# Altium schematic sheet CANOPi_Baseboard_LTE.SchDoc
size A4; DocumentNumber: 4; SheetNumber: 4; SheetTotal: 5; CopyrightYear: 2021
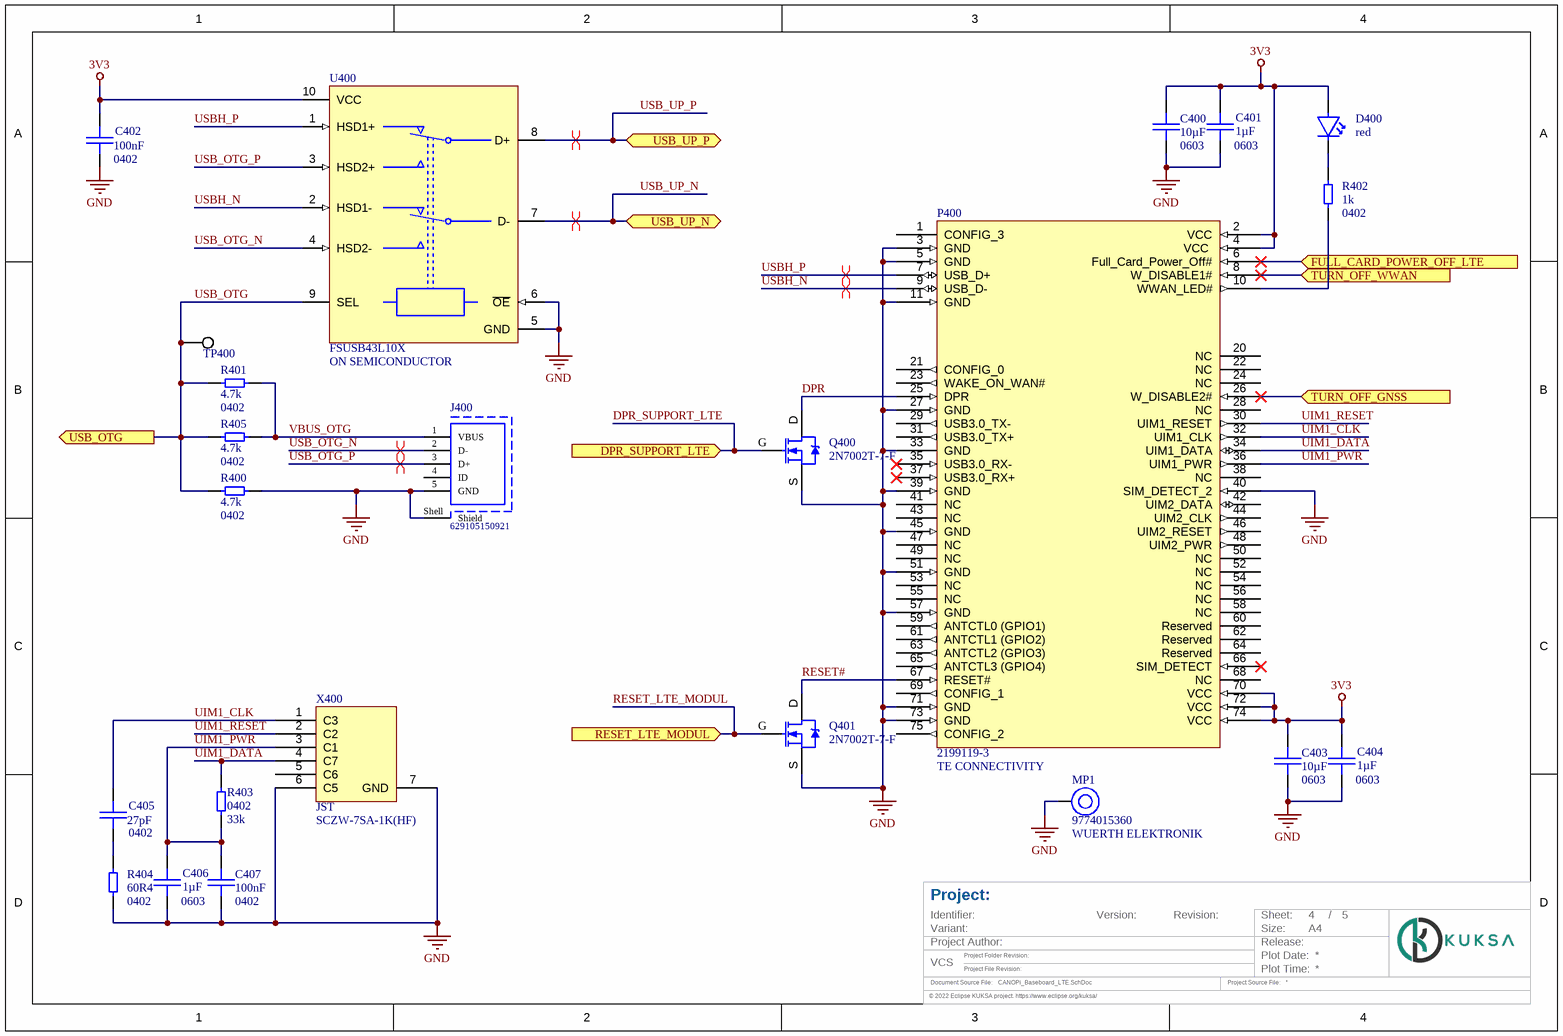
[diagram p0: CANOPi_Baseboard_LTE.SchDoc]

## Parts
C400  Capacitance: 10µF  Case: 0603  [CAP 0603 [1608 Metric] X080 N]  (hidden comment: CAP 0603 10µF -20% +20% 6.3V X5R)
C401  Capacitance: 1µF  Case: 0603  [CAP 0603 [1608 Metric] X080 N]  (hidden comment: CAP 0603 1u -10% +10% 10V X7R)
C402  Capacitance: 100nF  Case: 0402  [CAP 0402 [1005 Metric] X050 N]  (hidden comment: CAP 0402 100n -10% +10% 6.3V X7R)
C403  Capacitance: 10µF  Case: 0603  [CAP 0603 [1608 Metric] X080 N]  (hidden comment: CAP 0603 10µF -20% +20% 6.3V X5R)
C404  Capacitance: 1µF  Case: 0603  [CAP 0603 [1608 Metric] X080 N]  (hidden comment: CAP 0603 1u -10% +10% 10V X7R)
C405  Case: 0402  Capacitance: 27pF  [CAP 0402 [1005 Metric] X050 N]  (hidden comment: CAP 0402 27p -2% +2% 25V C0G)
C406  Capacitance: 1µF  Case: 0603  [CAP 0603 [1608 Metric] X080 N]  (hidden comment: CAP 0603 1u -10% +10% 10V X7R)
C407  Capacitance: 100nF  Case: 0402  [CAP 0402 [1005 Metric] X050 N]  (hidden comment: CAP 0402 100n -10% +10% 6.3V X7R)
D400  Colour LED1: red  [WUERTH ELEKTRONIK - WL-SMSW]  (hidden comment: WUERTH ELEKTRONIK - 155124RS73200)
J400  629105150921  [629105150921]
MP1  Manufacturer Part Number: 9774015360  Manufacturer: WUERTH ELEKTRONIK  [WUERTH ELEKTRONIK - 9774015360]  (hidden comment: WUERTH ELEKTRONIK - 9774015360)
P400  Manufacturer Part Number: 2199119-3  Manufacturer: TE CONNECTIVITY  [M.2 (NGFF) Connectors]  (hidden comment: TE CONNECTIVITY - 2199119-3)
Q400  Manufacturer Part Number: 2N7002T-7-F  [DIODES INCORPORATED - SOT523]  (hidden comment: DIODES INCORPORATED - 2N7002T)
Q401  Manufacturer Part Number: 2N7002T-7-F  [DIODES INCORPORATED - SOT523]  (hidden comment: DIODES INCORPORATED - 2N7002T)
R400  Resistance: 4.7k  Case: 0402  [RES 0402 [1005 Metric]_N]  (hidden comment: RES 0402 4K7 1% 0W0625)
R401  Resistance: 4.7k  Case: 0402  [RES 0402 [1005 Metric]_N]  (hidden comment: RES 0402 4K7 1% 0W0625)
R402  Case: 0402  Resistance: 1k  [RES 0402 [1005 Metric]_N]  (hidden comment: RES 0402 1K 1% 0W0625)
R403  Case: 0402  Resistance: 33k  [RES 0402 [1005 Metric]_N]  (hidden comment: RES 0402 33K 1% 0W0625)
R404  Resistance: 60R4  Case: 0402  [RES 0402 [1005 Metric]_N]  (hidden comment: RES 0402 60R4 1% 0W0625)
R405  Resistance: 4.7k  Case: 0402  [RES 0402 [1005 Metric]_N]  (hidden comment: RES 0402 4K7 1% 0W0625)
TP400  Testpad, 0.8mm x 0.8mm, round  [Testpad, 0.8mm x 0.8mm, round]  (value not drawn)  (no BOM)
U400  Manufacturer Part Number: FSUSB43L10X  Manufacturer: ON SEMICONDUCTOR  [ON SEMICONDUCTOR - FSUSB43L10X]  (hidden comment: ON SEMICONDUCTOR - FSUSB43L10X)
X400  Manufacturer: JST  Manufacturer Part Number: SCZW-7SA-1K(HF)  [JST SCZW-7SA-1K(HF)]  (hidden comment: JST - SCZW-7SA-1K(HF))

## Ports
DPR_SUPPORT_LTE (in), FULL_CARD_POWER_OFF_LTE (in), RESET_LTE_MODUL (in), TURN_OFF_GNSS (in), TURN_OFF_WWAN (in), USB_OTG (out), USB_UP_N (bidir), USB_UP_P (bidir)

## Nets
3V3: C400.1 C401.1 C402.2 C403.1 C404.1 D400.A P400.2(VCC) P400.4(VCC) P400.70(VCC) P400.72(VCC) P400.74(VCC) U400.10(VCC)
GND: C400.2 C401.2 C402.1 C403.2 C404.2 C406.2 C407.2 J400.5(GND) J400.Shell(Shield) MP1.1 P400.3(GND) P400.5(GND) P400.11(GND) P400.27(GND) P400.33(GND) P400.39(GND) P400.40(SIM_DETECT_2) P400.45(GND) P400.51(GND) P400.57(GND) P400.71(GND) P400.73(GND) Q400.S Q401.S R400.1 R404.1 U400.5(GND) U400.6(~{OE}) X400.6(C5) X400.7(GND)
DPR: P400.25(DPR) Q400.D
DPR_SUPPORT_LTE: Q400.G ; port DPR_SUPPORT_LTE
FULL_CARD_POWER_OFF_LTE: P400.6(Full_Card_Power_Off#) ; port FULL_CARD_POWER_OFF_LTE
RESET#: P400.67(RESET#) Q401.D
RESET_LTE_MODUL: Q401.G ; port RESET_LTE_MODUL
TURN_OFF_GNSS: P400.26(W_DISABLE2#) ; port TURN_OFF_GNSS
TURN_OFF_WWAN: P400.8(W_DISABLE1#) ; port TURN_OFF_WWAN
UIM1_CLK: C405.2 P400.32(UIM1_CLK) X400.1(C3)
UIM1_DATA: P400.34(UIM1_DATA) R403.1 X400.4(C7)
UIM1_PWR: C406.1 C407.1 P400.36(UIM1_PWR) R403.2 X400.3(C1)
UIM1_RESET: P400.30(UIM1_RESET) X400.2(C2)
USB_OTG: R400.2 R401.2 R405.2 TP400.1 U400.9(SEL) ; port USB_OTG
USB_OTG_N: J400.2(D-) U400.4(HSD2-)
USB_OTG_P: J400.3(D+) U400.3(HSD2+)
USB_UP_N: U400.7(D-) ; port USB_UP_N
USB_UP_P: U400.8(D+) ; port USB_UP_P
USBH_N: P400.9(USB_D-) U400.2(HSD1-)
USBH_P: P400.7(USB_D+) U400.1(HSD1+)
VBUS_OTG: J400.1(VBUS) R401.1 R405.1
NetC405_1: C405.1 R404.2
NetD400_C: D400.C R402.2
NetP400_10: P400.10(WWAN_LED#) R402.1

Not connected (* = marked no-connect by the designer): J400 4(ID); P400 1(CONFIG_3) 20(NC) 21(CONFIG_0) 22(NC) 23(WAKE_ON_WAN#) 24(NC) 28(NC) 29(USB3.0_TX-) 31(USB3.0_TX+) 35(USB3.0_RX-)* 37(USB3.0_RX+)* 38(NC) 41(NC) 42(UIM2_DATA) 43(NC) 44(UIM2_CLK) 46(UIM2_RESET) 47(NC) 48(UIM2_PWR) 49(NC) 50(NC) 52(NC) 53(NC) 54(NC) 55(NC) 56(NC) 58(NC) 59(ANTCTL0_(GPIO1)) 60(Reserved) 61(ANTCTL1_(GPIO2)) 62(Reserved) 63(ANTCTL2_(GPIO3)) 64(Reserved) 65(ANTCTL3_(GPIO4)) 66(SIM_DETECT)* 68(NC) 69(CONFIG_1) 75(CONFIG_2); X400 5(C6)

## Layout directives
differential pair: USB_OTG_N, USB_OTG_P, USB_UP_N, USB_UP_P, USBH_N, USBH_P

## Notes on the sheet
- Project:
- Identifier:
- Version:
- Revision:
- Sheet:
- /
- VCS
- Variant:
- Document Source File:
- Project Author:
- Project Folder Revision:
- Project File Revision:
- Project Source File:
- Plot Date:
- Size:
- Plot Time:
- Release:
- A4
- © 2022 Eclipse KUKSA project. https://www.eclipse.org/kuksa/
- Drawn by:
- © Robert Bosch GmbH         . All rights reserved, also regarding any disposal, exploitation, reproduction, editing, distribution, as well as in the event of applications for industrial property rights.

## Library data of the parts
C400 C403 = CMP-06061-3: SMT 10µF ±20% 6,3 V Keramikkondensatoren X5R; Manufacturer Part Number: GRM188R60J106ME84; Manufacturer: MURATA; Voltage Rating: 6,3V; Assembly: yes; Operating Temperature max: 85°C; IPC Footprint Naming: CAPC1608X080; Mounting Type: SMT; Dielectric Type: X5R; Value: 10µF; ComponentLink1Description: Datasheet; Capacitance Tolerance pos: 20%; ComponentLink1URL: https://search.murata.co.jp/Ceramy/image/img/A01X/G101/ENG/GRM188R60J106ME84-01.pdf; Operating Temperature min: -55°C; Capacitance Tolerance neg: -20%
C401 C404 C406 = CMP-02997-5: SMD/SMT 0603 10V -10% +10% X7R - Multilayer Ceramic Capacitors MLCC; Manufacturer Part Number: GRM188R71A105KA61#; Manufacturer: MURATA; Capacitance Tolerance pos: 10%; Value: 1µF; Assembly: yes; IPC Footprint Naming: CAPC1608X080; Voltage Rating: 10V; Mounting Type: SMT; Operating Temperature max: 125°C; Operating Temperature min: -55°C; ComponentLink1Description: Datasheet; Capacitance Tolerance neg: -10%; ComponentLink1URL: http://psearch.en.murata.com/capacitor/lineup/grm/; Dielectric Type: X7R
C402 C407 = CMP-04212-4: SMD/SMT 0402 6.3V -10% +10% X7R - Multilayer Ceramic Capacitors MLCC; Manufacturer: MURATA; Manufacturer Part Number: GRM155R70J104KA01#; Capacitance Tolerance pos: 10%; Value: 100nF; Assembly: yes; Operating Temperature min: -55°C; Voltage Rating: 6.3V; Operating Temperature max: 125°C; ComponentLink1URL: http://psearch.en.murata.com/capacitor/lineup/grm/; IPC Footprint Naming: CAPC1005X050; Capacitance Tolerance neg: -10%; ComponentLink1Description: Datasheet; Dielectric Type: X7R; Mounting Type: SMT
C405 = CMP-03814-4: SMD/SMT 0402 25V -2% +2% C0G - Multilayer Ceramic Capacitors MLCC; Manufacturer: MURATA; Manufacturer Part Number: GRM1555C1E270GA01#; Assembly: yes; Capacitance Tolerance pos: 2%; Value: 27pF; Dielectric Type: C0G (NP0); ComponentLink1Description: Datasheet; ComponentLink1URL: http://psearch.en.murata.com/capacitor/lineup/grm/; IPC Footprint Naming: CAPC1005X050; Voltage Rating: 25V; Operating Temperature min: -55°C; Mounting Type: SMT; Operating Temperature max: 125°C; Capacitance Tolerance neg: -2%
D400 = CMP-11201-1: LED, RED, Right Angle SMD 3.2*1.0mm WL-SMSW SMT Mono-color Side view Waterclear; View Angle: 120°; Wavelength LED1: 470nm; Reverse Voltage LED1: 5V; Forward Voltage LED1: 2V; Luminous Intensity LED1: 150mcd; Forward Current LED1: 25mA; Assembly: yes; Case: 1305; Operating Temperature max: 85°C; ComponentLink1Description: Datahseet; Manufacturer: WUERTH ELEKTRONIK; Operating Temperature min: -40°C; ComponentLink1URL: https://katalog.we-online.de/led/datasheet/155124BS73200.pdf; Mounting Type: SMT; Manufacturer Part Number: 155124RS73200
J400 = CMP-1502-03249-1: Micro USB 2.0 Type AB Receptacle WR-COM, Horizontal, SMT; Manufacturer: Wurth Elektronik; Rated Current: 1.8A; Contact Resistance: 30mOhm; Working Voltage: 30VAC; Publisher: WurthElektronik; Part Number: 629105150921; Operating Temperature: -40to85degC; Gender: Receptacle; Packaging: TapeandReel; Connector Type: MicroUSB2.0TypeAB; Datasheet URL: https://katalog.we-online.de/em/datasheet/629105150921.pdf; Mounting Technology: SMT; Orientation: Horizontal; Package Reference: 629105150921; Manufacturer URL: http://www.we-online.de
MP1 = CMP-12571-3: WA-SMSI SMT Steel Spacer with internal Thread, OD 6mm, M3 x 1.5mm; Assembly: yes; Operating Temperature max: 150°C; ComponentLink1URL: https://www.we-online.com/components/products/datasheet/9774015360.pdf; Operating Temperature min: -55°C; ComponentLink1Description: Manufacturer Link
P400 = CMP-06102-7: The M.2 (Next Generation Form Factor) product line is a natural transition from the Mini Card and Half Mini Card to a smaller form factor in both size and volume.; Voltage Rating: 50V; Pitch Spacing: 500µm; Gender: male; Current Rating: 500mA; Assembly: yes; ComponentLink1Description: Datasheet; Operating Temperature min: -40°C; Number of Pins: 67; Operating Temperature max: 80°C; Mounting Type: SMT; Number of Rows: 2
Q400 Q401 = CMP-11252-1: N-CHANNEL ENHANCEMENT MODE FIELD EFFECT TRANSISTOR; Assembly: yes; Drain Current DC: 150mA; Drain Source On Resistance: 2; Drain Source Voltage: 60V; Gate Source Voltage: 20V; Threshold Voltage: 2V; Mounting Type: SMT; Operating Temperature min: -55°C; ComponentLink1Description: Manufacturer Link; Transistor Polarity: N-Channel; Manufacturer: DIODES INCORPORATED; Operating Temperature max: 150°C; ComponentLink1URL: https://www.diodes.com/assets/Datasheets/ds30301.pdf; IPC Footprint Naming: SOT523; Case: SOT523
R400 R401 R405 = CMP-00920-7: RC0402 series chip resistor with lead-free terminations made by thick film process; Manufacturer Part Number: RC0402FR-074K7L; Manufacturer: YAGEO; Value: 4.7k; Power Rating: 62.5mW; Assembly: yes; Voltage Rating: 50V; Current Rating: 1A; Temperature Coefficient: ±100ppm/K; ComponentLink1URL: https://www.yageo.com/upload/media/product/productsearch/datasheet/rchip/PYu-RC_Group_51_RoHS_L_10.pdf; Operating Temperature max: 155°C; IPC Footprint Naming: RESC1005X04; Resistor Element Type: Thick Film; Mounting Type: SMT; Operating Temperature min: -55°C; ComponentLink1Description: Datasheet; Resistance Tolerance: 1%
R402 = CMP-00843-5: RC0402 series chip resistor with lead-free terminations made by thick film process; Manufacturer Part Number: RC0402FR-071KL; Manufacturer: YAGEO; Power Rating: 62.5mW; Current Rating: 1A; Temperature Coefficient: ±100ppm/K; Voltage Rating: 50V; Assembly: yes; Resistance Tolerance: 1%; ComponentLink1URL: http://www.yageo.com/documents/recent/PYu-RC0402_51_RoHS_L_6.pdf; Mounting Type: SMT; Value: 1k; Operating Temperature min: -55°C; ComponentLink1Description: Datasheet; IPC Footprint Naming: RESC1005X04; Operating Temperature max: 155°C; Resistor Element Type: Thick Film
R403 = CMP-01017-5: RC0402 series chip resistor with lead-free terminations made by thick film process; Manufacturer: YAGEO; Manufacturer Part Number: RC0402FR-0733KL; Assembly: yes; Power Rating: 62.5mW; Voltage Rating: 50V; Temperature Coefficient: ±100ppm/K; Current Rating: 1A; Operating Temperature max: 155°C; ComponentLink1URL: http://www.yageo.com/documents/recent/PYu-RC0402_51_RoHS_L_6.pdf; Resistor Element Type: Thick Film; Value: 33k; Mounting Type: SMT; ComponentLink1Description: Datasheet; IPC Footprint Naming: RESC1005X04; Operating Temperature min: -55°C; Resistance Tolerance: 1%
R404 = CMP-00705-5: RC0402 series chip resistor with lead-free terminations made by thick film process; Manufacturer Part Number: RC0402FR-0760R4L; Manufacturer: YAGEO; Temperature Coefficient: ±100ppm/K; Current Rating: 1A; Power Rating: 62.5mW; Voltage Rating: 50V; Assembly: yes; Value: 60.4; ComponentLink1URL: http://www.yageo.com/documents/recent/PYu-RC0402_51_RoHS_L_6.pdf; Operating Temperature max: 155°C; ComponentLink1Description: Datasheet; Resistor Element Type: Thick Film; IPC Footprint Naming: RESC1005X04; Resistance Tolerance: 1%; Mounting Type: SMT; Operating Temperature min: -55°C
TP400 = CMP-00390-13: Assembly: no; Case: 0.8x0.8mm, round
U400 = CMP-11250-2: Low-Power, Two-Port, High-Speed, USB2.0 (480Mbps) Switch; Supply Voltage min: 2,4V; Assembly: yes; Supply Voltage max: 4,4V; Analog Switch Type: USB Two-Port Switch; No. of Channels: 2:1; On State Resistance max: 4,5; ComponentLink1Description: Manufacturer Link; Mounting Type: SMT; ComponentLink1URL: https://www.onsemi.com/pdf/datasheet/fsusb43-d.pdf; Operating Temperature max: 85°C; Case: UQFN10; Operating Temperature min: -40°C
X400 = CMP-06150-9: SIM-Kartenleser aufklappbar und sperrfähig; Assembly: yes; Current Rating: 700mA; Memory Type: SIM; Pitch Spacing: 0mm; Case: SIM-Kartenhalter; ComponentLink1Description: Datasheet; ComponentLink1URL: http://www.farnell.com/datasheets/2280558.pdf; Mounting Type: SMT; Number of Pins: 7; Number of Rows: 0; Operating Temperature max: 85°C; Operating Temperature min: -25°C